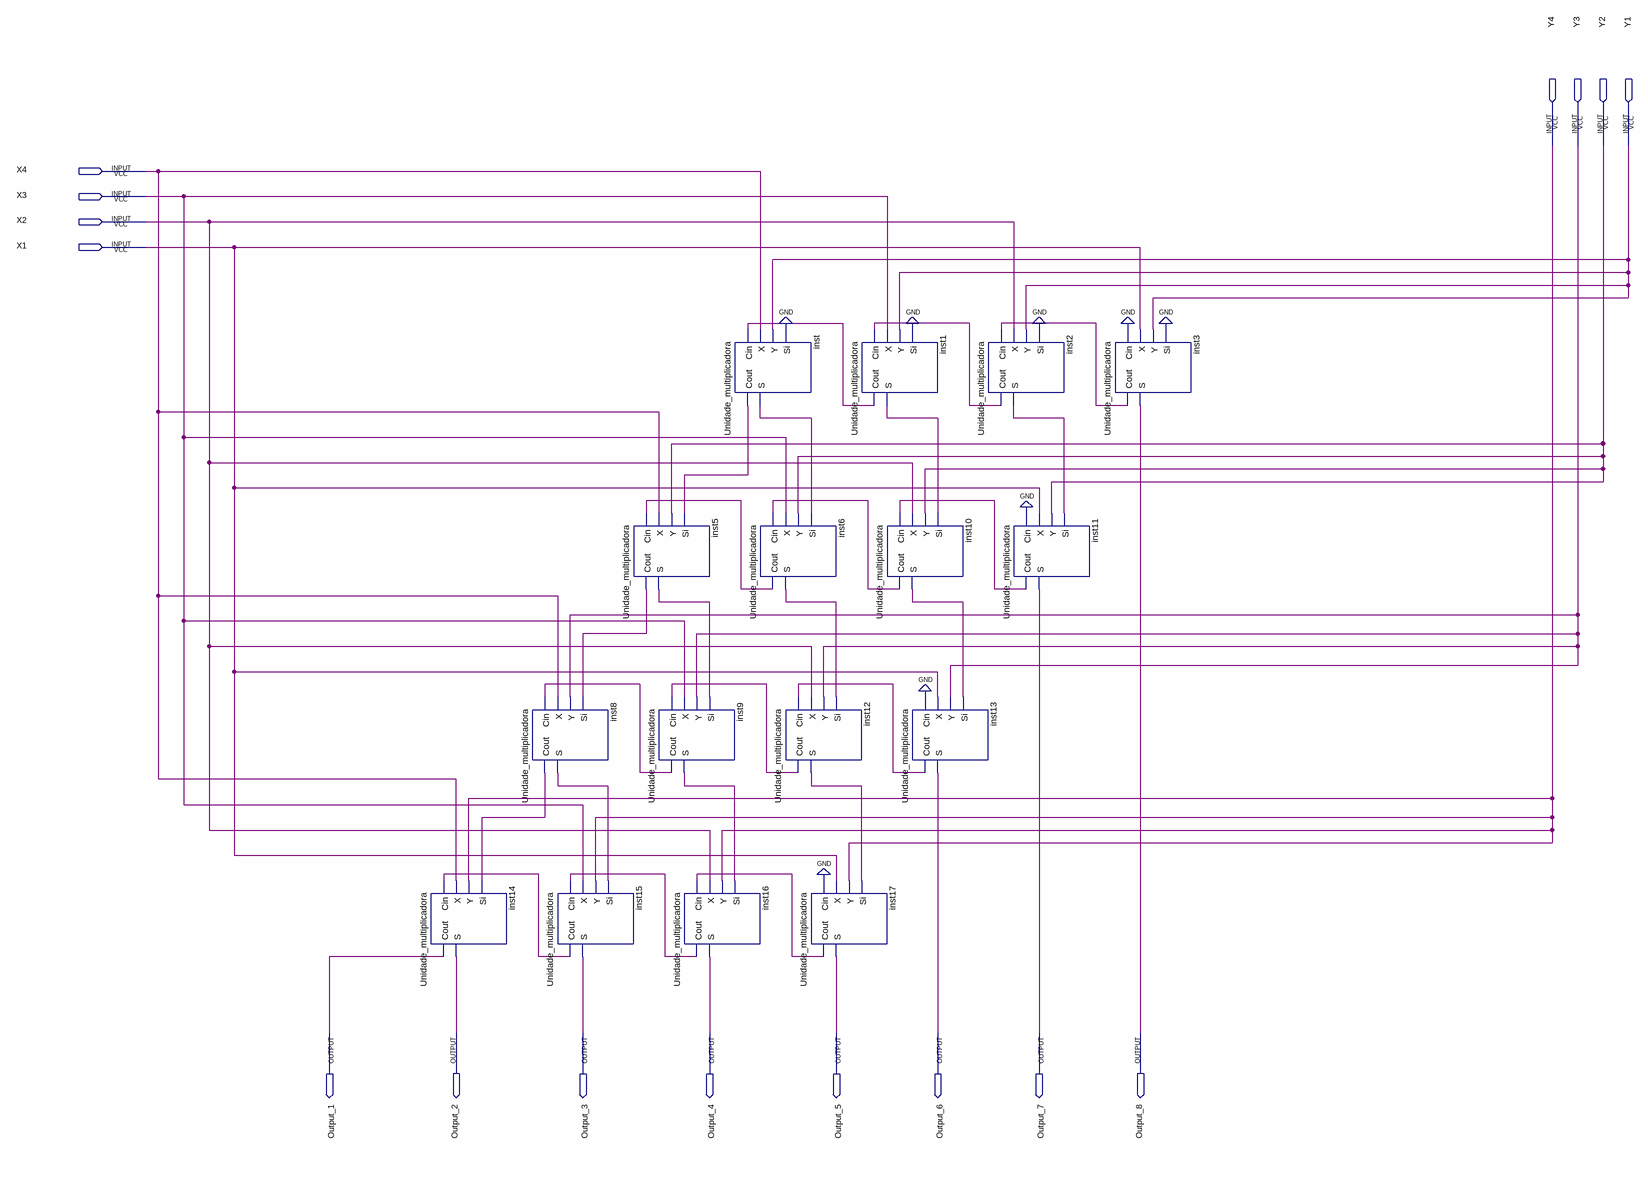
[diagram p0: schematic sheet]
// Quartus schematic multiplicador4bits.bdf as structural Verilog: 16 symbols, 16 pins
module multiplicador4bits (
  input  Y4,
  input  Y3,
  input  Y2,
  input  Y1,
  input  X4,
  input  X3,
  input  X2,
  input  X1,
  output Output_1,
  output Output_2,
  output Output_3,
  output Output_4,
  output Output_5,
  output Output_6,
  output Output_7,
  output Output_8
);

  wire inst1_cout, inst1_s, inst2_cout, inst2_s, inst3_cout, inst5_cout, inst5_s, inst6_cout, inst6_s,
       inst8_cout, inst8_s, inst9_cout, inst9_s, inst10_cout, inst10_s, inst11_cout, inst12_cout, inst12_s,
       inst13_cout, inst15_cout, inst16_cout, inst17_cout, inst_cout, inst_s;

  Unidade_multiplicadora inst14 (.Cin(inst15_cout), .X(X4), .Y(Y4), .Si(inst8_cout), .Cout(Output_1), .S(Output_2));
  Unidade_multiplicadora inst8 (.Cin(inst9_cout), .X(X4), .Y(Y3), .Si(inst5_cout), .Cout(inst8_cout), .S(inst8_s));
  Unidade_multiplicadora inst15 (.Cin(inst16_cout), .X(X3), .Y(Y4), .Si(inst8_s), .Cout(inst15_cout), .S(Output_3));
  Unidade_multiplicadora inst5 (.Cin(inst6_cout), .X(X4), .Y(Y2), .Si(inst_cout), .Cout(inst5_cout), .S(inst5_s));
  Unidade_multiplicadora inst9 (.Cin(inst12_cout), .X(X3), .Y(Y3), .Si(inst5_s), .Cout(inst9_cout), .S(inst9_s));
  Unidade_multiplicadora inst16 (.Cin(inst17_cout), .X(X2), .Y(Y4), .Si(inst9_s), .Cout(inst16_cout), .S(Output_4));
  Unidade_multiplicadora inst (.Cin(inst1_cout), .X(X4), .Y(Y1), .Si(1'b0), .Cout(inst_cout), .S(inst_s));
  Unidade_multiplicadora inst6 (.Cin(inst10_cout), .X(X3), .Y(Y2), .Si(inst_s), .Cout(inst6_cout), .S(inst6_s));
  Unidade_multiplicadora inst12 (.Cin(inst13_cout), .X(X2), .Y(Y3), .Si(inst6_s), .Cout(inst12_cout), .S(inst12_s));
  Unidade_multiplicadora inst17 (.Cin(1'b0), .X(X1), .Y(Y4), .Si(inst12_s), .Cout(inst17_cout), .S(Output_5));
  Unidade_multiplicadora inst1 (.Cin(inst2_cout), .X(X3), .Y(Y1), .Si(1'b0), .Cout(inst1_cout), .S(inst1_s));
  Unidade_multiplicadora inst10 (.Cin(inst11_cout), .X(X2), .Y(Y2), .Si(inst1_s), .Cout(inst10_cout), .S(inst10_s));
  Unidade_multiplicadora inst13 (.Cin(1'b0), .X(X1), .Y(Y3), .Si(inst10_s), .Cout(inst13_cout), .S(Output_6));
  Unidade_multiplicadora inst2 (.Cin(inst3_cout), .X(X2), .Y(Y1), .Si(1'b0), .Cout(inst2_cout), .S(inst2_s));
  Unidade_multiplicadora inst11 (.Cin(1'b0), .X(X1), .Y(Y2), .Si(inst2_s), .Cout(inst11_cout), .S(Output_7));
  Unidade_multiplicadora inst3 (.Cin(1'b0), .X(X1), .Y(Y1), .Si(1'b0), .Cout(inst3_cout), .S(Output_8));
endmodule
